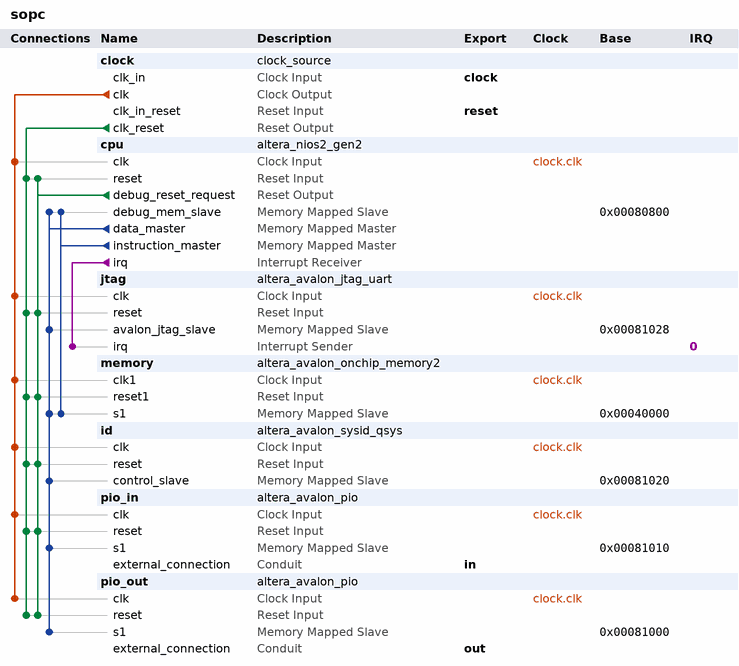
[diagram p0: system contents]
# Platform Designer (Qsys) system sopc, Cyclone V 5CSEMA5F31C6
# Parameters at their usual value, and those the tool derives, are not listed.
package require -exact qsys 18.0
create_system sopc
set_project_property DEVICE_FAMILY {Cyclone V}
set_project_property DEVICE 5CSEMA5F31C6

add_instance clock clock_source 18.0
set_instance_parameter_value clock clockFrequency 50000000

add_instance cpu altera_nios2_gen2 18.0
set_instance_parameter_value cpu dcache_size 2048
set_instance_parameter_value cpu exceptionSlave memory.s1
set_instance_parameter_value cpu icache_size 4096
set_instance_parameter_value cpu impl Fast
set_instance_parameter_value cpu resetSlave memory.s1

add_instance jtag altera_avalon_jtag_uart 18.0
set_instance_parameter_value jtag simInteractiveOptions NO_INTERACTIVE_WINDOWS

add_instance memory altera_avalon_onchip_memory2 18.0
set_instance_parameter_value memory dataWidth 32
set_instance_parameter_value memory dualPort false
set_instance_parameter_value memory initMemContent true
set_instance_parameter_value memory initializationFileName onchip_mem.hex
set_instance_parameter_value memory memorySize 204800

add_instance id altera_avalon_sysid_qsys 18.0
set_instance_parameter_value id id 0

add_instance pio_in altera_avalon_pio 18.0
set_instance_parameter_value pio_in direction Input
set_instance_parameter_value pio_in width 8

add_instance pio_out altera_avalon_pio 18.0
set_instance_parameter_value pio_out direction Output
set_instance_parameter_value pio_out width 8

# connections
add_connection clock.clk cpu.clk clock
add_connection clock.clk id.clk clock
add_connection clock.clk jtag.clk clock
add_connection clock.clk memory.clk1 clock
add_connection clock.clk pio_in.clk clock
add_connection clock.clk pio_out.clk clock
add_connection clock.clk_reset cpu.reset reset
add_connection clock.clk_reset id.reset reset
add_connection clock.clk_reset jtag.reset reset
add_connection clock.clk_reset memory.reset1 reset
add_connection clock.clk_reset pio_in.reset reset
add_connection clock.clk_reset pio_out.reset reset
add_connection cpu.debug_reset_request cpu.reset reset
add_connection cpu.debug_reset_request id.reset reset
add_connection cpu.debug_reset_request jtag.reset reset
add_connection cpu.debug_reset_request memory.reset1 reset
add_connection cpu.debug_reset_request pio_in.reset reset
add_connection cpu.debug_reset_request pio_out.reset reset
add_connection cpu.data_master cpu.debug_mem_slave avalon
set_connection_parameter_value cpu.data_master/cpu.debug_mem_slave baseAddress 0x00080800
add_connection cpu.data_master id.control_slave avalon
set_connection_parameter_value cpu.data_master/id.control_slave baseAddress 0x00081020
add_connection cpu.data_master jtag.avalon_jtag_slave avalon
set_connection_parameter_value cpu.data_master/jtag.avalon_jtag_slave baseAddress 0x00081028
add_connection cpu.data_master memory.s1 avalon
set_connection_parameter_value cpu.data_master/memory.s1 baseAddress 0x00040000
add_connection cpu.data_master pio_in.s1 avalon
set_connection_parameter_value cpu.data_master/pio_in.s1 baseAddress 0x00081010
add_connection cpu.data_master pio_out.s1 avalon
set_connection_parameter_value cpu.data_master/pio_out.s1 baseAddress 0x00081000
add_connection cpu.instruction_master cpu.debug_mem_slave avalon
set_connection_parameter_value cpu.instruction_master/cpu.debug_mem_slave baseAddress 0x00080800
add_connection cpu.instruction_master memory.s1 avalon
set_connection_parameter_value cpu.instruction_master/memory.s1 baseAddress 0x00040000
add_connection cpu.irq jtag.irq interrupt
set_connection_parameter_value cpu.irq/jtag.irq irqNumber 0

# exported interfaces
add_interface clock clock sink
set_interface_property clock EXPORT_OF clock.clk_in
add_interface in conduit end
set_interface_property in EXPORT_OF pio_in.external_connection
add_interface out conduit end
set_interface_property out EXPORT_OF pio_out.external_connection
add_interface reset reset sink
set_interface_property reset EXPORT_OF clock.clk_in_reset

set_interconnect_requirement {$system} qsys_mm.clockCrossingAdapter HANDSHAKE
set_interconnect_requirement {$system} qsys_mm.enableEccProtection FALSE
set_interconnect_requirement {$system} qsys_mm.insertDefaultSlave FALSE
set_interconnect_requirement {$system} qsys_mm.maxAdditionalLatency 1

save_system sopc.qsys
